# EAGLE board UniversalPPU (EAGLE 6.5.0)
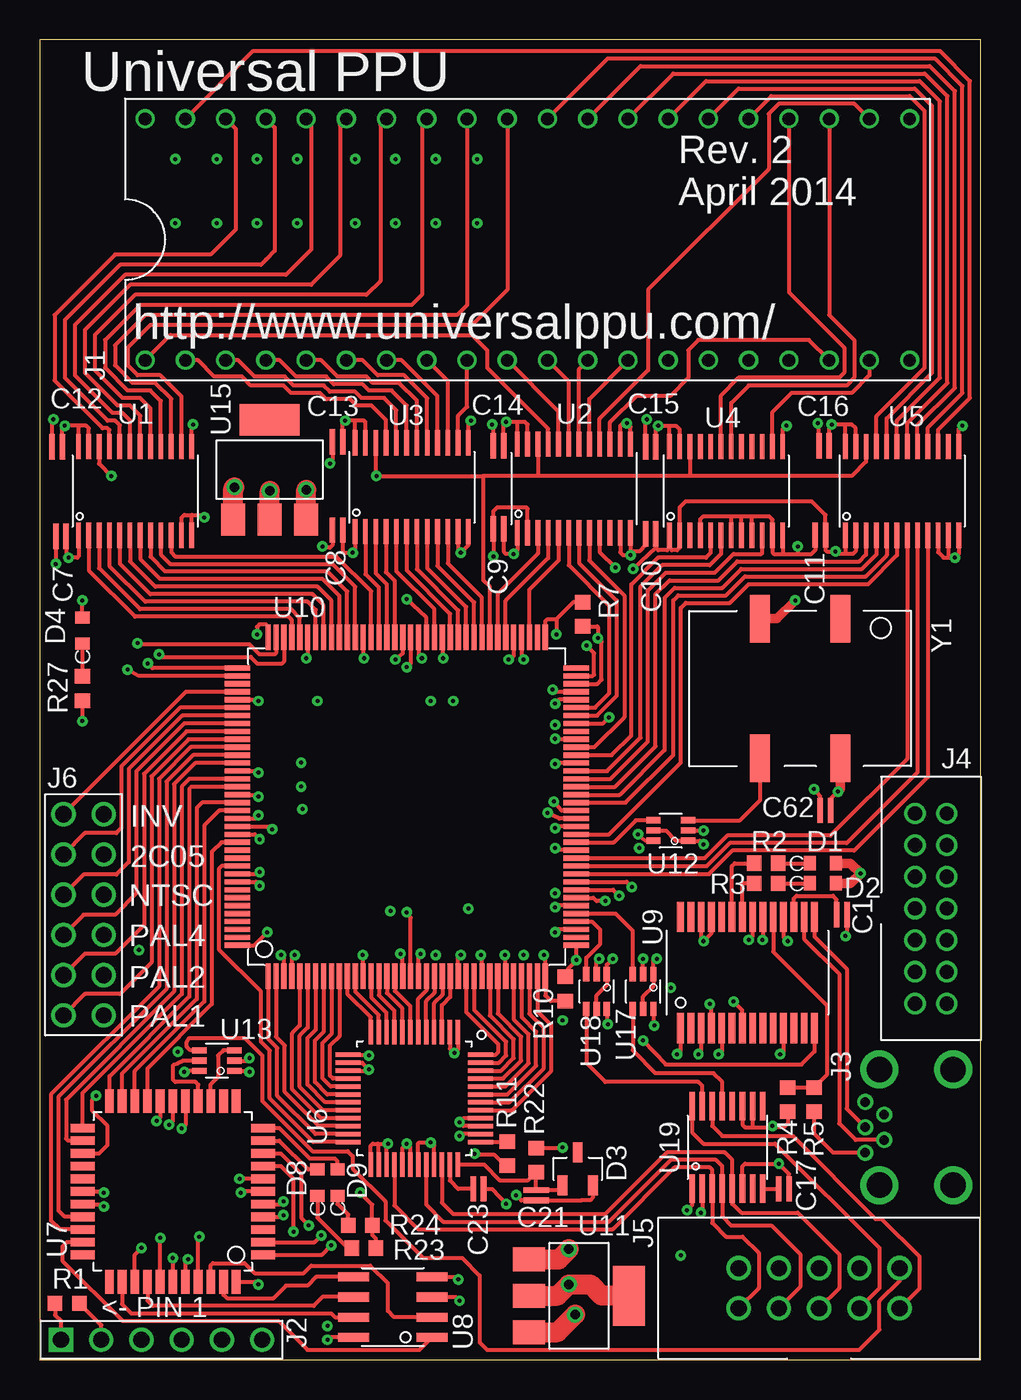
[diagram p6: board, top side]
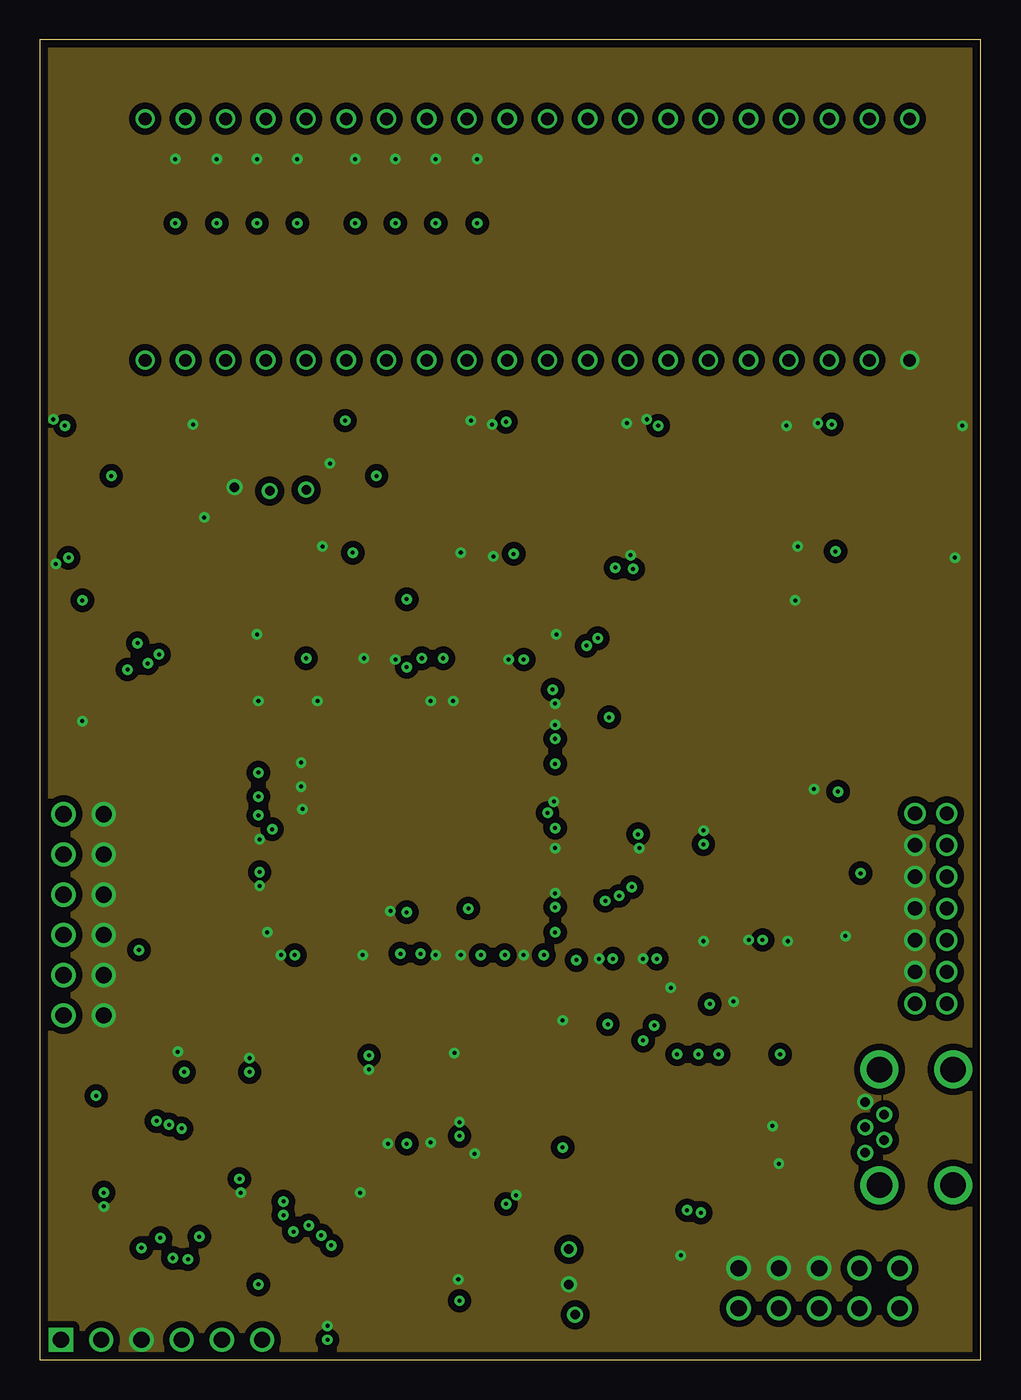
[diagram p7: board, inner layer Route2]
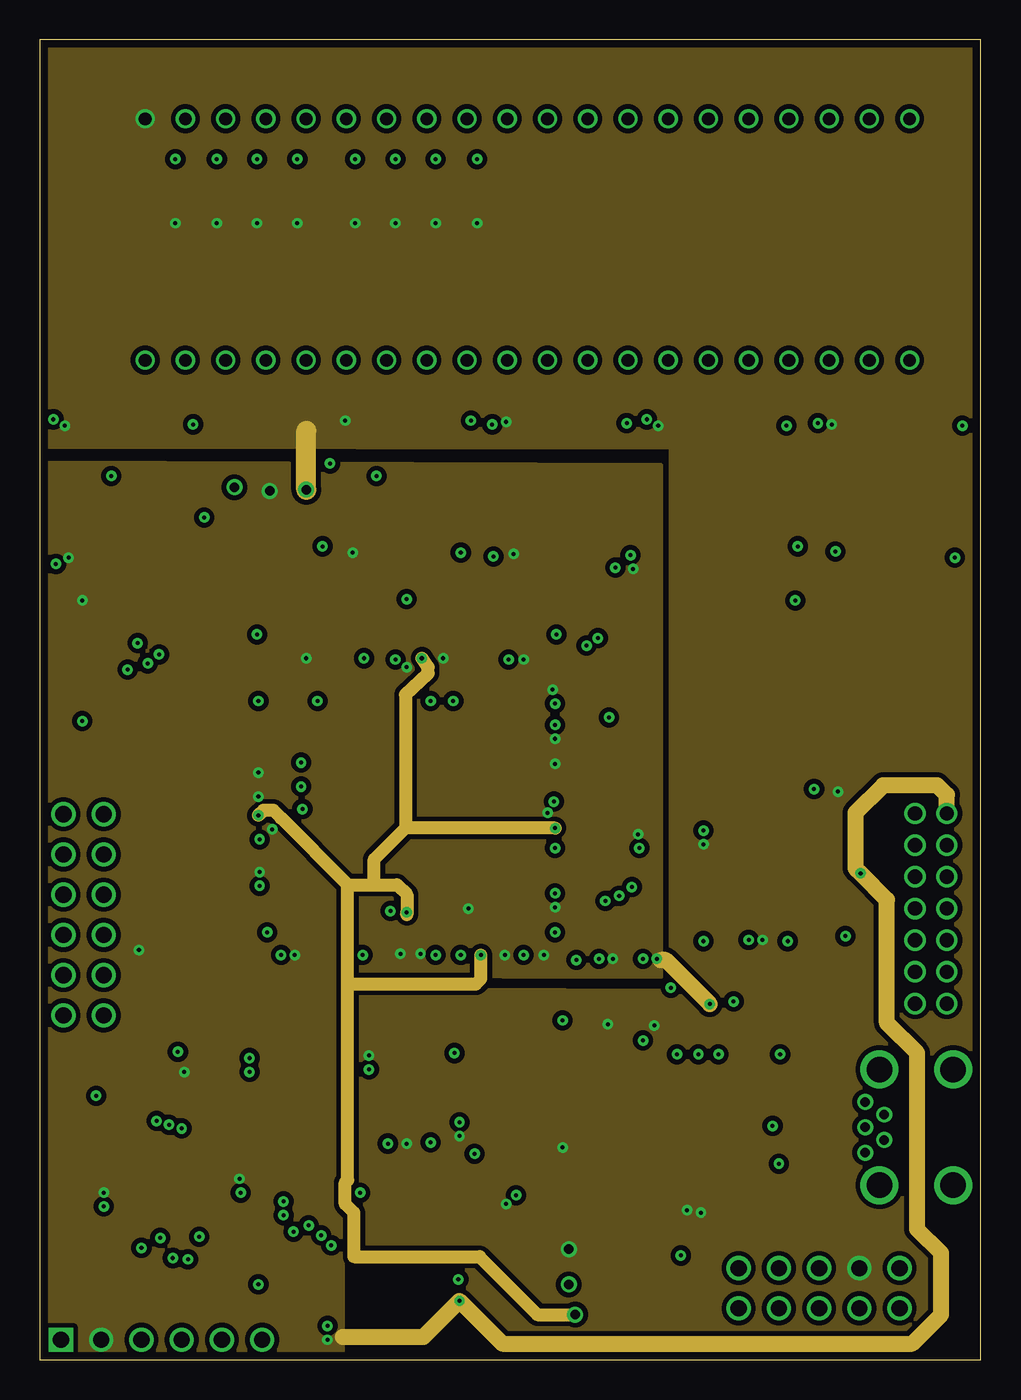
[diagram p8: board, inner layer Route15]
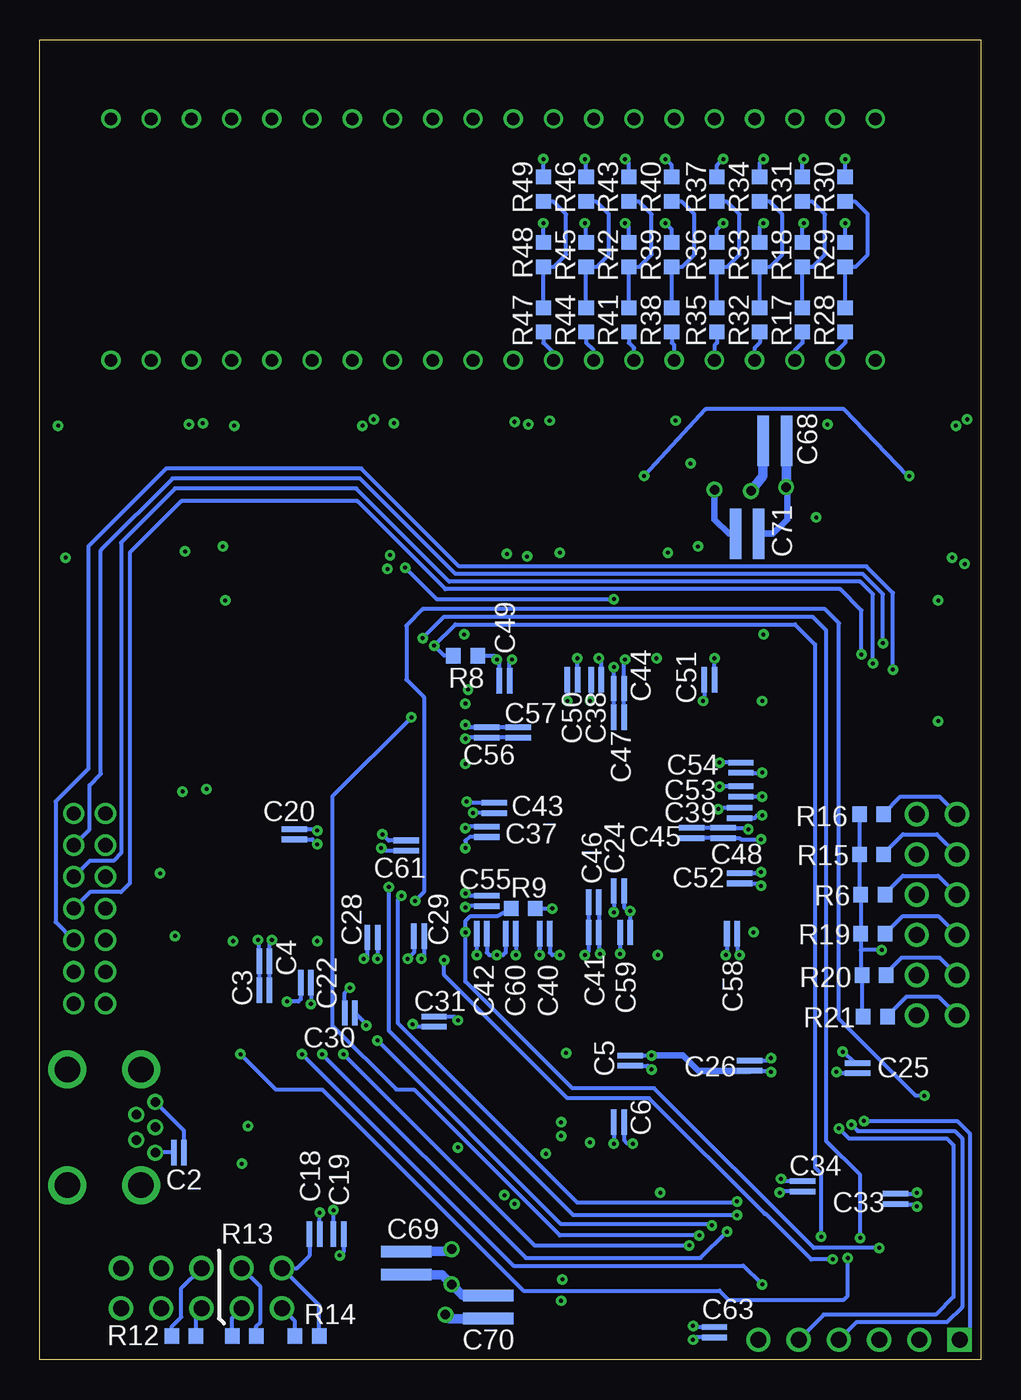
[diagram p9: board, bottom side, seen from below]

Size 59.43 x 83.34 mm. Coordinates in mm from the lower left corner, seen from the top.
Outline: 0,0 59.43,0 59.43,83.34 0,83.34 0,0
Copper layers (1+2*15+16): Top 0.0178mm / dielectric 12mil / Route2 0.0356mm / dielectric 28mil / Route15 0.0356mm / dielectric 12mil / Bottom 0.0178mm
Design rules "SSC-EAGLE-4Lyr_v1.0.0.3": minimum track width 6mil, minimum drill 8mil, track to track 6mil, track to pad 6mil, pad to pad 6mil, via to via 6mil, smd to smd 6mil, copper to edge 20mil, drill to drill 16mil, minimum pad ring 8mil, minimum via ring 8mil, stop-mask expansion 3mil, vias tented up to drill 0mil, thermal gap 10mil

## Footprints (pad centres in the part's own frame; a part is rotated, then mirrored left to right if it is on the bottom)
TDK_C0816 = smd 0.35 x 1.6: 1 -0.325,0; 2 0.325,0
TDK_C1632 = smd 0.725 x 3.2: 1 -0.738,0; 2 0.738,0
LED_0603 = smd 0.76 x 0.91: A 0.825,0; C -0.825,0
SOT-23-3 = smd 0.61 x 1.27: 1 -0.96,-1.04; 2 0.96,-1.04; 3 0,1.04
DIP40 = drill 0.8: 1 -7.62,24.13; 2 -7.62,21.59; 3 -7.62,19.05; 4 -7.62,16.51; 5 -7.62,13.97; 6 -7.62,11.43; 7 -7.62,8.89; 8 -7.62,6.35; 9 -7.62,3.81; 10 -7.62,1.27; 11 -7.62,-1.27; 12 -7.62,-3.81; 13 -7.62,-6.35; 14 -7.62,-8.89; 15 -7.62,-11.43; 16 -7.62,-13.97; 17 -7.62,-16.51; 18 -7.62,-19.05; 19 -7.62,-21.59; 20 -7.62,-24.13; 21 7.62,-24.13; 22 7.62,-21.59; 23 7.62,-19.05; 24 7.62,-16.51; 25 7.62,-13.97; 26 7.62,-11.43; 27 7.62,-8.89; 28 7.62,-6.35; 29 7.62,-3.81; 30 7.62,-1.27; 31 7.62,1.27; 32 7.62,3.81; 33 7.62,6.35; 34 7.62,8.89; 35 7.62,11.43; 36 7.62,13.97; 37 7.62,16.51; 38 7.62,19.05; 39 7.62,21.59; 40 7.62,24.13
6SIP = drill 1.016 square: 1 0,6.35 | drill 1.016: 2 0,3.81; 3 0,1.27; 4 0,-1.27; 5 0,-3.81; 6 0,-6.35
USB = drill 0.6: 1 1.6,-3.275; 2 0.8,-2.075; 3 0,-3.275; 4 -0.8,-2.075; 5 -1.6,-3.275 | drill 1.6: S1 3.65,-2.375; S2 3.65,2.275; S3 -3.65,-2.375; S4 -3.65,2.275
14PIN_2MM = drill 0.9: 1 1,-6; 2 -1,-6; 3 1,-4; 4 -1,-4; 5 1,-2; 6 -1,-2; 7 1,0; 8 -1,0; 9 1,2; 10 -1,2; 11 1,4; 12 -1,4; 13 1,6; 14 -1,6
10PIN = drill 1.016: 1 -5.08,-1.27; 2 -5.08,1.27; 3 -2.54,-1.27; 4 -2.54,1.27; 5 0,-1.27; 6 0,1.27; 7 2.54,-1.27; 8 2.54,1.27; 9 5.08,-1.27; 10 5.08,1.27
12PIN = drill 1.016: 1 -6.35,1.27; 2 -6.35,-1.27; 3 -3.81,1.27; 4 -3.81,-1.27; 5 -1.27,1.27; 6 -1.27,-1.27; 7 1.27,1.27; 8 1.27,-1.27; 9 3.81,1.27; 10 3.81,-1.27; 11 6.35,1.27; 12 6.35,-1.27
0603 = smd 0.914 x 0.965: P$1 -0.762,0; P$2 0.762,0
TSSOP24 = smd 1.6 x 0.3: 1 -2.8,3.575; 2 -2.8,2.925; 3 -2.8,2.275; 4 -2.8,1.625; 5 -2.8,0.975; 6 -2.8,0.325; 7 -2.8,-0.325; 8 -2.8,-0.975; 9 -2.8,-1.625; 10 -2.8,-2.275; 11 -2.8,-2.925; 12 -2.8,-3.575; 13 2.8,-3.575; 14 2.8,-2.925; 15 2.8,-2.275; 16 2.8,-1.625; 17 2.8,-0.975; 18 2.8,-0.325; 19 2.8,0.325; 20 2.8,0.975; 21 2.8,1.625; 22 2.8,2.275; 23 2.8,2.925; 24 2.8,3.575
LQFP-48 = smd 0.28 x 1.56: 1 -2.75,-4.18; 2 -2.25,-4.18; 3 -1.75,-4.18; 4 -1.25,-4.18; 5 -0.75,-4.18; 6 -0.25,-4.18; 7 0.25,-4.18; 8 0.75,-4.18; 9 1.25,-4.18; 10 1.75,-4.18; 11 2.25,-4.18; 12 2.75,-4.18; 25 2.75,4.18; 26 2.25,4.18; 27 1.75,4.18; 28 1.25,4.18; 29 0.75,4.18; 30 0.25,4.18; 31 -0.25,4.18; 32 -0.75,4.18; 33 -1.25,4.18; 34 -1.75,4.18; 35 -2.25,4.18; 36 -2.75,4.18 | smd 1.56 x 0.28: 13 4.18,-2.75; 14 4.18,-2.25; 15 4.18,-1.75; 16 4.18,-1.25; 17 4.18,-0.75; 18 4.18,-0.25; 19 4.18,0.25; 20 4.18,0.75; 21 4.18,1.25; 22 4.18,1.75; 23 4.18,2.25; 24 4.18,2.75; 37 -4.18,2.75; 38 -4.18,2.25; 39 -4.18,1.75; 40 -4.18,1.25; 41 -4.18,0.75; 42 -4.18,0.25; 43 -4.18,-0.25; 44 -4.18,-0.75; 45 -4.18,-1.25; 46 -4.18,-1.75; 47 -4.18,-2.25; 48 -4.18,-2.75
TQFP44 = smd 1.5 x 0.55: 1 -5.7,4; 2 -5.7,3.2; 3 -5.7,2.4; 4 -5.7,1.6; 5 -5.7,0.8; 6 -5.7,0; 7 -5.7,-0.8; 8 -5.7,-1.6; 9 -5.7,-2.4; 10 -5.7,-3.2; 11 -5.7,-4; 23 5.7,-4; 24 5.7,-3.2; 25 5.7,-2.4; 26 5.7,-1.6; 27 5.7,-0.8; 28 5.7,0; 29 5.7,0.8; 30 5.7,1.6; 31 5.7,2.4; 32 5.7,3.2; 33 5.7,4 | smd 0.55 x 1.5: 12 -4,-5.7; 13 -3.2,-5.7; 14 -2.4,-5.7; 15 -1.6,-5.7; 16 -0.8,-5.7; 17 0,-5.7; 18 0.8,-5.7; 19 1.6,-5.7; 20 2.4,-5.7; 21 3.2,-5.7; 22 4,-5.7; 34 4,5.7; 35 3.2,5.7; 36 2.4,5.7; 37 1.6,5.7; 38 0.8,5.7; 39 0,5.7; 40 -0.8,5.7; 41 -1.6,5.7; 42 -2.4,5.7; 43 -3.2,5.7; 44 -4,5.7
8PIN = smd 1.97 x 0.57: 1 -2.475,1.905; 2 -2.475,0.635; 3 -2.475,-0.635; 4 -2.475,-1.905; 5 2.475,-1.905; 6 2.475,-0.635; 7 2.475,0.635; 8 2.475,1.905
SSOP-28 = smd 1.9 x 0.43: 1 -3.505,4.225; 2 -3.505,3.575; 3 -3.505,2.925; 4 -3.505,2.275; 5 -3.505,1.625; 6 -3.505,0.975; 7 -3.505,0.325; 8 -3.505,-0.325; 9 -3.505,-0.975; 10 -3.505,-1.625; 11 -3.505,-2.275; 12 -3.505,-2.925; 13 -3.505,-3.575; 14 -3.505,-4.225; 15 3.505,-4.225; 16 3.505,-3.575; 17 3.505,-2.925; 18 3.505,-2.275; 19 3.505,-1.625; 20 3.505,-0.975; 21 3.505,-0.325; 22 3.505,0.325; 23 3.505,0.975; 24 3.505,1.625; 25 3.505,2.275; 26 3.505,2.925; 27 3.505,3.575; 28 3.505,4.225
TQG144 = smd 1.6 x 0.33: 1 -10.7,8.75; 2 -10.7,8.25; 3 -10.7,7.75; 4 -10.7,7.25; 5 -10.7,6.75; 6 -10.7,6.25; 7 -10.7,5.75; 8 -10.7,5.25; 9 -10.7,4.75; 10 -10.7,4.25; 11 -10.7,3.75; 12 -10.7,3.25; 13 -10.7,2.75; 14 -10.7,2.25; 15 -10.7,1.75; 16 -10.7,1.25; 17 -10.7,0.75; 18 -10.7,0.25; 19 -10.7,-0.25; 20 -10.7,-0.75; 21 -10.7,-1.25; 22 -10.7,-1.75; 23 -10.7,-2.25; 24 -10.7,-2.75; 25 -10.7,-3.25; 26 -10.7,-3.75; 27 -10.7,-4.25; 28 -10.7,-4.75; 29 -10.7,-5.25; 30 -10.7,-5.75; 31 -10.7,-6.25; 32 -10.7,-6.75; 33 -10.7,-7.25; 34 -10.7,-7.75; 35 -10.7,-8.25; 36 -10.7,-8.75; 73 10.7,-8.75; 74 10.7,-8.25; 75 10.7,-7.75; 76 10.7,-7.25; 77 10.7,-6.75; 78 10.7,-6.25; 79 10.7,-5.75; 80 10.7,-5.25; 81 10.7,-4.75; 82 10.7,-4.25; 83 10.7,-3.75; 84 10.7,-3.25; 85 10.7,-2.75; 86 10.7,-2.25; 87 10.7,-1.75; 88 10.7,-1.25; 89 10.7,-0.75; 90 10.7,-0.25; 91 10.7,0.25; 92 10.7,0.75; 93 10.7,1.25; 94 10.7,1.75; 95 10.7,2.25; 96 10.7,2.75; 97 10.7,3.25; 98 10.7,3.75; 99 10.7,4.25; 100 10.7,4.75; 101 10.7,5.25; 102 10.7,5.75; 103 10.7,6.25; 104 10.7,6.75; 105 10.7,7.25; 106 10.7,7.75; 107 10.7,8.25; 108 10.7,8.75 | smd 0.33 x 1.6: 37 -8.75,-10.7; 38 -8.25,-10.7; 39 -7.75,-10.7; 40 -7.25,-10.7; 41 -6.75,-10.7; 42 -6.25,-10.7; 43 -5.75,-10.7; 44 -5.25,-10.7; 45 -4.75,-10.7; 46 -4.25,-10.7; 47 -3.75,-10.7; 48 -3.25,-10.7; 49 -2.75,-10.7; 50 -2.25,-10.7; 51 -1.75,-10.7; 52 -1.25,-10.7; 53 -0.75,-10.7; 54 -0.25,-10.7; 55 0.25,-10.7; 56 0.75,-10.7; 57 1.25,-10.7; 58 1.75,-10.7; 59 2.25,-10.7; 60 2.75,-10.7; 61 3.25,-10.7; 62 3.75,-10.7; 63 4.25,-10.7; 64 4.75,-10.7; 65 5.25,-10.7; 66 5.75,-10.7; 67 6.25,-10.7; 68 6.75,-10.7; 69 7.25,-10.7; 70 7.75,-10.7; 71 8.25,-10.7; 72 8.75,-10.7; 109 8.75,10.7; 110 8.25,10.7; 111 7.75,10.7; 112 7.25,10.7; 113 6.75,10.7; 114 6.25,10.7; 115 5.75,10.7; 116 5.25,10.7; 117 4.75,10.7; 118 4.25,10.7; 119 3.75,10.7; 120 3.25,10.7; 121 2.75,10.7; 122 2.25,10.7; 123 1.75,10.7; 124 1.25,10.7; 125 0.75,10.7; 126 0.25,10.7; 127 -0.25,10.7; 128 -0.75,10.7; 129 -1.25,10.7; 130 -1.75,10.7; 131 -2.25,10.7; 132 -2.75,10.7; 133 -3.25,10.7; 134 -3.75,10.7; 135 -4.25,10.7; 136 -4.75,10.7; 137 -5.25,10.7; 138 -5.75,10.7; 139 -6.25,10.7; 140 -6.75,10.7; 141 -7.25,10.7; 142 -7.75,10.7; 143 -8.25,10.7; 144 -8.75,10.7
SOT-223 = smd 2 x 1.5: 1 -3.15,2.3; 2 -3.15,0; 3 -3.15,-2.3 | smd 2 x 3.8: 4 3.15,0
R-PDSO-G6 = smd 0.9 x 0.4: 1 -1.1,0.65; 2 -1.1,0; 3 -1.1,-0.65; 4 1.1,-0.65; 5 1.1,0; 6 1.1,0.65
R-PDSO-G16 = smd 1.8 x 0.35: 1 -2.6,2.223; 2 -2.6,1.587; 3 -2.6,0.953; 4 -2.6,0.318; 5 -2.6,-0.318; 6 -2.6,-0.953; 7 -2.6,-1.587; 8 -2.6,-2.223; 9 2.6,-2.223; 10 2.6,-1.587; 11 2.6,-0.953; 12 2.6,-0.318; 13 2.6,0.318; 14 2.6,0.953; 15 2.6,1.587; 16 2.6,2.223
OSC = smd 3 x 1.27: 1 -4.4,2.54; 2 -4.4,-2.54; 3 4.4,-2.54; 4 4.4,2.54

## Placement (x,y rotation side)
C1  0.1u  [TDK_C0816]  50.64,28.1 0 top
C2  10n  [TDK_C0816]  50.64,13.1 180 bottom
C3  0.1u  [TDK_C0816]  45.24,23.34 180 bottom
C4  4.7u  [TDK_C0816]  45.24,25.16 180 bottom
C5  0.1u  [TDK_C0816]  22.15,18.89 90 bottom
C6  0.1u  [TDK_C0816]  22.86,15 180 bottom
C7  0.1u  [TDK_C0816]  1.35,51.99 0 top
C8  0.1u  [TDK_C0816]  18.81,52.39 0 top
C9  0.1u  [TDK_C0816]  28.97,52.47 0 top
C10  0.1u  [TDK_C0816]  38.58,52.15 0 top
C11  0.1u  [TDK_C0816]  49.29,52.07 0 top
C12  0.1u  [TDK_C0816]  1.11,57.63 0 top
C13  0.1u  [TDK_C0816]  18.81,57.94 0 top
C14  0.1u  [TDK_C0816]  28.97,57.71 0 top
C15  0.1u  [TDK_C0816]  38.58,57.63 0 top
C16  0.1u  [TDK_C0816]  49.53,57.71 0 top
C17  0.22u  [TDK_C0816]  46.99,10.79 180 top
C18  0.1u  [TDK_C0816]  42.07,7.94 0 bottom
C19  0.1u  [TDK_C0816]  40.56,7.94 180 bottom
C20  0.1u  [TDK_C0816]  43.34,33.18 270 bottom
C21  0.1u  [TDK_C0816]  31.35,10.4 90 top
C22  0.1u  [TDK_C0816]  42.62,23.81 0 bottom
C23  0.1u  [TDK_C0816]  27.7,10.79 0 top
C24  4.7u  [TDK_C0816]  22.86,29.61 180 bottom
C25  0.1u  [TDK_C0816]  7.78,18.41 270 bottom
C26  0.1u  [TDK_C0816]  14.61,18.57 270 bottom
C28  0.1u  [TDK_C0816]  38.42,26.67 180 bottom
C29  0.1u  [TDK_C0816]  35.48,26.75 180 bottom
C30  0.1u  [TDK_C0816]  39.85,21.91 0 bottom
C31  0.1u  [TDK_C0816]  34.53,21.35 270 bottom
C33  0.1u  [TDK_C0816]  5.4,10.16 90 bottom
C34  0.1u  [TDK_C0816]  11.27,10.95 90 bottom
C37  4.7u  [TDK_C0816]  31.19,33.34 90 bottom
C38  4.7u  [TDK_C0816]  24.29,42.94 0 bottom
C39  4.7u  [TDK_C0816]  15.24,34.53 270 bottom
C40  0.47u  [TDK_C0816]  27.54,26.91 180 bottom
C41  4.7u  [TDK_C0816]  24.45,26.99 0 bottom
C42  4.7u  [TDK_C0816]  31.51,26.91 180 bottom
C43  4.7u  [TDK_C0816]  30.72,34.85 270 bottom
C44  4.7u  [TDK_C0816]  22.86,42.39 180 bottom
C45  4.7u  [TDK_C0816]  18.26,33.26 90 bottom
C46  4.7u  [TDK_C0816]  24.45,28.89 0 bottom
C47  4.7u  [TDK_C0816]  22.86,40.56 180 bottom
C48  0.47u  [TDK_C0816]  16.27,33.26 90 bottom
C49  4.7u  [TDK_C0816]  30.08,42.86 180 bottom
C50  0.47u  [TDK_C0816]  25.8,42.94 0 bottom
C51  0.47u  [TDK_C0816]  17.14,42.94 0 bottom
C52  4.7u  [TDK_C0816]  15.24,30.4 90 bottom
C53  0.47u  [TDK_C0816]  15.16,35.88 270 bottom
C54  0.47u  [TDK_C0816]  15.16,37.39 270 bottom
C55  4.7u  [TDK_C0816]  31.19,28.97 270 bottom
C56  0.47u  [TDK_C0816]  31.19,39.61 270 bottom
C57  0.47u  [TDK_C0816]  29.21,39.61 270 bottom
C58  4.7u  [TDK_C0816]  15.72,26.91 180 bottom
C59  0.47u  [TDK_C0816]  22.46,26.99 180 bottom
C60  0.47u  [TDK_C0816]  29.69,26.91 0 bottom
C61  0.1u  [TDK_C0816]  36.27,32.46 90 bottom
C62  0.1u  [TDK_C0816]  49.61,34.69 0 top
C63  0.1u  [TDK_C0816]  16.83,1.75 270 bottom
C68  10u  [TDK_C1632]  13.02,58.02 180 bottom
C69  10u  [TDK_C1632]  36.27,6.11 90 bottom
C70  10u  [TDK_C1632]  31.11,3.33 270 bottom
C71  10u  [TDK_C1632]  14.76,52.15 180 bottom
D1  DIODE  [LED_0603]  49.45,31.35 0 top
D2  DIODE  [LED_0603]  49.45,30.08 0 top
D3  AD1580  [SOT-23-3]  33.97,12.06 0 top
D4  DIODE  [LED_0603]  2.7,46.04 90 top
D8  DIODE  [LED_0603]  17.54,11.19 90 top
D9  DIODE  [LED_0603]  18.81,11.19 90 top
J1  DIP40  [DIP40]  30.8,70.72 90 top
J2  PICKIT3  [6SIP]  7.7,1.27 90 top
J3  USB  [USB]  55.4,14.68 270 top
J4  JTAG  [14PIN_2MM]  56.28,28.5 180 top
J5  10PIN  [10PIN]  49.21,4.52 0 top
J6  12PIN  [12PIN]  2.78,28.1 90 top
R1  10k  [0603]  1.75,3.57 0 top
R2  100  [0603]  45.88,31.35 180 top
R3  100  [0603]  45.88,30.08 180 top
R4  10k  [0603]  47.23,16.43 90 top
R5  4.7k  [0603]  48.9,16.43 270 top
R6  10k  [0603]  6.83,29.37 180 bottom
R7  1k  [0603]  34.29,47.07 270 top
R8  330  [0603]  32.54,44.45 0 bottom
R9  4.7k  [0603]  28.89,28.5 0 bottom
R10  4.7k  [0603]  33.18,23.42 270 top
R11  536  [0603]  29.53,13.02 90 top
R12  75  [0603]  50.32,1.51 0 bottom
R13  75  [0603]  46.51,1.51 180 bottom
R14  75  [0603]  42.55,1.51 180 bottom
R15  10k  [0603]  6.91,31.91 180 bottom
R16  10k  [0603]  6.91,34.45 180 bottom
R17  10k  [0603]  11.27,65.64 90 bottom
R18  0  [0603]  11.27,69.77 90 bottom
R19  10k  [0603]  6.83,26.91 180 bottom
R20  10k  [0603]  6.75,24.29 180 bottom
R21  10k  [0603]  6.67,21.67 180 bottom
R22  1k  [0603]  31.35,12.62 90 top
R23  100  [0603]  20.48,7.06 180 top
R24  100  [0603]  20.24,8.49 180 top
R27  100  [0603]  2.7,42.39 90 top
R28  10k  [0603]  8.57,65.64 90 bottom
R29  0  [0603]  8.57,69.77 90 bottom
R30  0  [0603]  8.57,73.9 270 bottom
R31  0  [0603]  11.27,73.9 270 bottom
R32  10k  [0603]  13.97,65.64 90 bottom
R33  0  [0603]  13.97,69.77 90 bottom
R34  0  [0603]  13.97,73.9 270 bottom
R35  10k  [0603]  16.67,65.64 90 bottom
R36  0  [0603]  16.67,69.77 90 bottom
R37  0  [0603]  16.67,73.9 270 bottom
R38  10k  [0603]  19.53,65.64 90 bottom
R39  0  [0603]  19.53,69.77 90 bottom
R40  0  [0603]  19.53,73.9 270 bottom
R41  10k  [0603]  22.23,65.64 90 bottom
R42  0  [0603]  22.23,69.77 90 bottom
R43  0  [0603]  22.23,73.9 270 bottom
R44  10k  [0603]  24.92,65.64 90 bottom
R45  0  [0603]  24.92,69.77 90 bottom
R46  0  [0603]  24.92,73.9 270 bottom
R47  10k  [0603]  27.62,65.64 90 bottom
R48  0  [0603]  27.62,69.77 90 bottom
R49  0  [0603]  27.62,73.9 270 bottom
U1  SN74LVC8T245  [TSSOP24]  6.03,54.85 90 top
U2  SN74LVC8T245  [TSSOP24]  33.73,55.01 90 top
U3  SN74LVC8T245  [TSSOP24]  23.5,55.09 90 top
U4  SN74LVC8T245  [TSSOP24]  43.34,54.85 90 top
U5  SN74LVC8T245  [TSSOP24]  54.45,54.85 90 top
U6  ADV7125  [LQFP-48]  23.65,16.51 180 top
U7  PIC18(L)F4XK22  [TQFP44]  8.41,10.64 180 top
U8  M25P40  [8PIN]  22.3,3.33 180 top
U9  FT232RL  [SSOP-28]  44.69,24.45 90 top
U10  XC6SLX9  [TQG144]  23.18,34.92 90 top
U11  1.2  [SOT-223]  34.05,4.05 0 top
U12  74LVC1T45  [R-PDSO-G6]  39.85,33.42 180 top
U13  74LVC1T45  [R-PDSO-G6]  11.19,18.89 180 top
U15  2.5  [SOT-223]  14.53,56.2 90 top
U17  74LVC1T45  [R-PDSO-G6]  38.1,23.26 270 top
U18  74LVC1T45  [R-PDSO-G6]  35.16,23.26 270 top
U19  TPD7S019  [R-PDSO-G16]  43.42,13.41 90 top
Y1  OSC  [OSC]  48.02,42.39 270 top

## Tracks (layer width: path | path; a pad name or v marks a point on that pad's centre or on a via)
+1V2  (via drill 0.25, 0.6 pad 0.25)
  Top 0.254: U10.128 13.62,34.17 v13.81,34.37 | U10.28 27.93,25.49 v27.86,25.56 | U10.52 32.64,33.67 v32.54,33.58 | U10.89 23.93,44.34 v24.13,44.29 | U10.19 23.43,27.93 v23.18,28.26
  Top 1.27: U11.3 32.7,1.75 v33.81,2.86
  Route15 0.813: 19.45,23.73 19.45,11.35 19.29,11.19 19.29,9.84 19.84,9.29 19.84,6.51 27.78,6.51 31.43,2.86 v33.81,2.86 | 19.45,23.73 19.45,30 | 19.45,30 21.12,30 | 19.45,23.73 27.54,23.73 27.86,24.05 v27.86,25.56 | v32.54,33.58 23.1,33.58 | v24.13,44.29 24.53,43.74 24.53,43.34 23.1,41.99 23.1,33.58 | 21.12,30 21.12,31.6 23.1,33.58 | 21.12,30 22.56,30 23.18,29.37 23.18,28.11 v23.18,28.26 | 19.45,30 C39.2 14.76,34.69 14.13,34.69 v13.81,34.37
  Bottom 0.254: C39.2 14.29,34.2 14.13,34.37 v13.81,34.37 | C40.2 v27.87,25.57 v27.86,25.56 | C38.2 23.96,44.28 v24.13,44.29 | C24.2 23.18,28.11 v23.18,28.26 | C37.2 32.46,33.66 v32.54,33.58
  Bottom 0.61: C70.2 33.55,2.6 v33.81,2.86
+2V5  (via drill 0.25, 0.6 pad 0.25)
  Top 0.254: U10.135 13.77,30.68 v13.89,30.8 | U10.129 14.59,33.67 v14.68,33.5 | U10.18 22.93,25.49 v22.78,25.64 | U10.20 23.93,25.52 v24.05,25.64 | U10.31 29.43,25.42 v29.37,25.56 | v31.83,25.56 31.93,25.46 U10.36 31.93,23 32.27,22.65 R10.P$2 | U10.42 32.72,28.68 v32.54,28.57 | U10.4 15.93,25.45 v16.11,25.56 | U10.53 32.82,34.17 v32.07,34.53 | U10.63 32.58,39.17 v32.54,39.21 | U10.90 23.43,43.99 v23.18,43.74 | U10.86 25.43,44.34 v25.48,44.29 | U10.76 30.43,44.26 v30.56,44.21 | U10.103 16.93,44.39 v16.83,44.29 | U10.122 13.7,37.17 v13.81,37.07 | U10.125 13.7,35.67 v13.81,35.56 | U9.4 42.41,22.36 v42.31,22.46 | v4.05,10.56 3.89,10.64 U7.28 | U7.7 v12.63,11.44 v12.62,11.43 | C7.2 1.67,50.79 v1.83,50.64 2.38,50.64 2.46,50.72 U1.1 | U3.1 19.92,51.11 v19.76,50.96 19.21,50.96 19.14,51.03 C8.2 | C9.2 29.3,51.03 29.45,50.88 v29.92,50.88 30.16,51.11 U2.1 | U13.6 9.27,18.24 v9.13,18.18 | v38.97,25.32 38.75,25.18 U17.1 38.75,23.59 38.1,22.94 U17.5 | J2.2 3.89,2.19 R1.P$2 | D4.A v2.7,47.94 | C10.2 38.9,51.28 | 38.9,51.28 v37.47,49.93 | U4.1 39.76,51.27 | 39.76,51.27 39.61,51.12 39.07,51.12 38.9,51.28 | 39.76,51.27 39.92,51.12 40.24,51.12 40.41,51.29 U4.2 40.41,53.83 40.8,54.21 48.74,54.21 49.62,53.33 C11.2 49.62,51.11 49.69,51.04 v50.24,51.04 50.4,50.88 50.8,50.88 | U5.2 51.53,51.05 51.36,50.88 50.8,50.88 | U5.1 50.88,50.96 50.8,50.88 | U10.60 32.59,37.67 v32.54,37.62 | U10.69 32.49,42.17 v32.38,42.31 | U18.5 35.16,23.02 35.81,23.67 U18.1 35.81,24.94 v36.2,25.32 | v37.78,33.18 37.94,33.02 38.26,32.78 38.73,32.78 U12.6 | U8.8 18.34,1.43 v18.18,1.27 | U8.3 26.27,3.97 v26.51,3.73
  Top 0.61: D1.A 51.2,31.35 v51.83,30.72 51.2,30.08 D2.A
  Top 1.27: U15.2 v14.53,54.85
  Route15 1.016: v42.31,22.46 39.53,25.24 39.21,25.24 | 19.13,1.43 24.21,1.43 v26.51,3.73 29.21,1.03 55.09,1.03 56.91,2.86 56.91,6.75 55.4,8.26 55.4,19.37 53.5,21.27 53.5,29.05 v51.83,30.72 51.51,31.04 51.51,34.53 53.26,36.27 56.67,36.27 57.28,35.67 J4.2
  Bottom 0.254: v13.89,30.8 13.97,30.72 15.07,30.72 C52.2 | C45.2 C48.2 14.69,33.58 v14.68,33.5 | C59.2 v22.79,25.63 v22.78,25.64 | v24.05,25.64 24.12,25.71 C41.2 C46.2 | C60.2 v29.36,25.57 v29.37,25.56 | C42.2 31.84,25.49 v31.83,25.56 | C55.2 32.55,28.65 v32.54,28.57 | C58.2 16.04,25.57 v16.11,25.56 | v32.54,39.21 32.47,39.28 C56.2 C57.2 | 13.81,36.99 v13.81,37.07 v13.82,37.06 C54.2 | C47.2 C44.2 23.18,43.73 v23.18,43.74 | C50.2 v25.47,44.28 v25.48,44.29 | C49.2 30.41,44.14 v30.56,44.21 30.72,44.45 R8.P$2 | C51.2 v16.82,44.28 v16.83,44.29 | C53.2 v13.82,35.55 v13.81,35.56 | C22.2 42.3,22.47 v42.31,22.46 | C33.2 4.06,10.48 v4.05,10.56 | C34.2 12.47,11.28 v12.62,11.43 | C25.2 9.12,18.09 v9.13,18.18 | C28.2 38.74,25.31 v38.97,25.32 | R16.P$2 R15.P$2 7.67,29.45 R6.P$2 R19.P$2 7.59,25.88 | 7.59,25.88 7.59,24.37 R20.P$2 7.51,21.75 R21.P$2 | R9.P$2 v27.07,28.5 | v6.27,25.88 7.59,25.88 | C43.2 31.98,34.52 v32.07,34.53 | C61.2 37.39,32.79 v37.78,33.18 | C63.2 18.09,1.42 v18.18,1.27 | C29.2 35.81,25.71 v36.2,25.32
  Bottom 0.61: v14.53,54.85 13.76,55.78 C68.2
  pour Route15 (isolate 0.305, no thermals): 0.16,56.67 39.21,56.52 39.21,24.13 19.13,24.21 19.13,0.24 0.16,0.32
+5V  (via drill 0.25, 0.6 pad 0.25)
  Top 0.254: U9.20 45.66,26.61 v45.64,26.51 | U6.29 22.9,13.38 v23.18,13.65 23.4,13.43 U6.30 | U6.13 20.67,19.26 v20.8,19.21 | U19.1 41.2,9.76 v40.88,9.45 | U19.2 41.83,9.37 v41.75,9.29 | U2.23 30.81,59.04 30.64,59.21 30.16,59.21 | C14.2 29.3,59.06 v29.45,59.21 30.16,59.21 | U2.24 30.16,59.21 | C15.2 38.9,58.82 v39.05,58.98 39.69,58.98 | 39.69,58.98 40.16,58.98 40.41,58.73 U4.23 | U4.24 39.76,58.9 39.69,58.98 | C16.2 49.85,58.9 v50.01,59.05 50.88,59.05 | U5.23 51.53,58.8 51.28,59.05 50.88,59.05 | U5.24 50.88,59.05 | C13.2 19.14,59.14 v19.29,59.29 19.92,59.29 | U3.23 20.57,59.2 20.48,59.29 19.92,59.29 | U3.24 19.92,59.29 | C12.2 1.44,58.82 v1.59,58.98 2.54,58.98 | U1.23 3.11,58.8 2.94,58.98 2.54,58.98 | U1.24 2.46,58.89 2.54,58.98 | U13.1 13.16,18.24 v13.26,18.18 | U17.6 38.75,21.34 v38.81,21.11 | U18.6 35.81,21.29 v35.88,21.19 | C23.2 28.57,10.79 v29.45,9.84 | R22.P$2 32.99,13.38 v33.02,13.41 | C62.2 50.01,35.49 v50.4,35.88 | U12.5 39.53,33.42 40.18,32.77 U12.1 41.69,32.77 v41.91,32.54 | U6.38 26.56,14.26 v26.51,14.13
  Top 0.61: Y1.4 50.56,36.04 v50.4,35.88
  Top 1.27: U11.1 32.78,6.35 v33.42,6.99 | U15.3 v16.83,54.93
  Route15 1.27: v16.83,54.93 16.83,58.66
  Bottom 0.254: v45.64,26.51 45.57,26.5 C4.2 C3.2 | C6.2 v23.18,13.66 v23.18,13.65 | C5.2 20.88,19.22 v20.8,19.21 | C19.2 40.89,9.44 v40.88,9.45 | C18.2 v41.74,9.28 v41.75,9.29 | C26.2 13.18,18.25 v13.26,18.18 | v38.81,21.11 38.81,21.2 C30.2 | C31.2 35.55,21.03 v35.88,21.19 | R29.P$2 v8.57,71.75 | R48.P$2 v27.62,71.75 | R18.P$2 11.27,71.68 v11.19,71.75 | R33.P$2 13.97,71.52 v13.73,71.75 | R36.P$2 16.67,71.36 v16.27,71.75 | R39.P$2 19.53,71.36 v19.92,71.75 | R42.P$2 22.23,71.52 v22.46,71.75 | R45.P$2 24.92,71.68 v25,71.75 | C20.2 42.22,32.85 v41.91,32.54
  Bottom 0.406: C26.2 17.85,18.25 18.81,19.21 v20.8,19.21 | C71.2 15.93,52.15 U15.3 v16.83,54.93
  Bottom 0.61: C69.2 33.55,6.85 v33.42,6.99
  pour Route15 (isolate 0.305, no thermals): 0.08,83.34 59.45,83.34 59.45,0 20,0 20,23.42 39.85,23.34 39.85,57.55 0.08,57.63
/CS
  Top 0.254: U2.17 34.71,60.66 J1.13
/INT
  Top 0.254: J1.19 52.39,62.15 51.28,61.04 47.47,61.04 46.26,59.84 U4.14
/RD
  Top 0.254: J1.24 47.31,67.39 50.8,63.9 50.8,62.31 50.48,61.99 44.13,61.99 43.01,60.87 U4.19
/RST
  Top 0.254: J1.22 51.44,79.3 46.67,79.3 46.04,78.66 46.04,75.17 38.42,67.55 38.42,62.47 35.36,59.41 U2.16
/WR
  Top 0.254: J1.23 49.85,65.96 51.44,64.37 51.44,61.99 50.96,61.52 44.77,61.52 43.66,60.41 U4.18
A0
  Top 0.254: U2.18 34.06,62.55 J1.12
A1
  Top 0.254: U2.19 33.41,61.76 J1.11
A2
  Top 0.254: U2.20 32.76,59.87 J1.10
A8
  Top 0.254: J1.30 35.88,82.15 56.52,82.15 58.26,80.41 58.26,61.04 56.08,58.85 U5.16
A9
  Top 0.254: J1.29 37.94,81.68 56.2,81.68 57.78,80.09 57.78,61.36 55.43,59 U5.17
A10
  Top 0.254: J1.28 40.01,81.2 55.88,81.2 57.31,79.77 57.31,61.67 54.78,59.14 U5.18
A11
  Top 0.254: J1.27 42.07,80.72 55.56,80.72 56.83,79.45 56.83,61.99 54.13,59.29 U5.19
A12
  Top 0.254: J1.26 44.13,80.25 55.24,80.25 56.36,79.14 56.36,62.31 53.48,59.43 U5.20
A13
  Top 0.254: J1.25 46.2,79.77 54.93,79.77 55.88,78.82 55.88,62.63 52.83,59.57 U5.21
AD0
  Top 0.254: J1.38 12.38,77.71 12.38,71.36 12.14,71.12 11.75,70.72 10.79,69.77 4.76,69.77 0.95,65.96 0.95,61.83 3.97,58.82 4.29,58.82 4.41,58.7 U1.21
AD1
  Top 0.254: J1.37 14.84,77.79 14.84,70.01 14.29,69.45 13.97,69.14 5.08,69.14 1.59,65.64 1.59,61.99 4.29,59.29 4.76,59.29 5.06,59 U1.20
AD2
  Top 0.254: J1.36 17.14,78.03 17.14,70.09 16.83,69.77 15.56,68.5 5.4,68.5 2.22,65.33 2.22,62.15 4.6,59.77 5.24,59.77 5.71,59.3 U1.19
AD3
  Top 0.254: J1.35 18.97,77.95 18.97,69.69 17.14,67.87 5.71,67.87 2.86,65.01 2.86,62.31 4.92,60.25 5.71,60.25 6.36,59.6 U1.18
AD4
  Top 0.254: J1.34 21.51,77.95 21.51,68.1 20.64,67.23 6.03,67.23 3.49,64.69 3.49,62.47 5.24,60.72 6.35,60.72 7.01,60.06 U1.17
AD5
  Top 0.254: J1.33 24.13,78.03 24.13,67.23 23.5,66.6 6.35,66.6 4.13,64.37 4.13,62.63 5.56,61.2 6.99,61.2 7.66,60.53 U1.16
AD6
  Top 0.254: J1.32 26.99,66.6 26.35,65.96 6.67,65.96 4.76,64.06 4.76,62.79 5.87,61.67 7.3,61.67 8.31,60.67 U1.15
AD7
  Top 0.254: J1.31 29.53,67.55 27.3,65.33 6.99,65.33 5.56,63.9 5.56,62.79 6.19,62.15 7.62,62.15 8.96,60.81 U1.14
ALE
  Top 0.254: J1.39 13.49,82.63 56.83,82.63 58.74,80.72 58.74,60.72 56.73,58.71 U5.15
CLK
  Top 0.254: J1.18 48.58,64.37 41.59,64.37 40.96,63.74 40.96,61.99 39.85,60.88 37.7,60.88 36.01,59.19 U2.15
CSYNC
  Top 0.254: U10.41 36.36,28.18 37.45,27.08 U17.3
D0
  Top 0.254: U3.21 21.87,59.33 20.95,60.25 20,60.25 19.61,60.64 18.1,60.64 17.7,61.04 15.88,61.04 15.4,61.52 13.34,61.52 12.78,62.07 11.03,62.07 10,63.1 J1.2
  Bottom 0.254: R28.P$1 8.57,64.21 9.21,63.58 J1.2
D1
  Top 0.254: U3.20 22.52,59.95 21.75,60.72 20.32,60.72 19.92,61.12 18.34,61.12 17.94,61.52 16.03,61.52 15.48,62.07 13.57,62.07 12.54,63.1 J1.3
  Bottom 0.254: R17.P$1 11.27,64.21 11.75,63.74 J1.3
D2
  Top 0.254: U3.19 23.17,60.25 22.23,61.2 20.8,61.2 20.4,61.59 18.57,61.59 18.1,62.07 16.19,62.07 15.16,63.1 J1.4
  Bottom 0.254: R32.P$1 13.97,64.21 14.29,63.9 J1.4
D3
  Top 0.254: U3.18 23.82,60.56 22.7,61.67 21.03,61.67 20.64,62.07 18.81,62.07 17.78,63.1 J1.5
  Bottom 0.254: R35.P$1 16.67,64.21 16.83,64.06 J1.5
D4
  Top 0.254: U3.17 24.47,60.7 23.02,62.15 21.35,62.15 20.4,63.1 J1.6
  Bottom 0.254: R38.P$1 19.53,64.21 19.37,64.06 J1.6
D5
  Top 0.254: U3.16 25.12,60.84 22.86,63.1 J1.7
  Bottom 0.254: R41.P$1 22.23,64.21 21.91,63.9 J1.7
D6
  Top 0.254: U3.15 25.77,61.78 J1.8
  Bottom 0.254: R44.P$1 24.92,64.21 24.45,63.74 J1.8
D7
  Top 0.254: U3.14 26.42,59.6 26.99,60.17 J1.9
  Bottom 0.254: R47.P$1 27.62,64.21 26.99,63.58 J1.9
DGND  (via drill 0.25, 0.6 pad 0.25)
  Top 0.254: U10.136 13.64,30.18 v13.89,29.92 | U10.130 13.58,33.17 v13.89,32.86 | U10.3 15.43,25.45 v15.24,25.56 | U10.77 29.93,44.45 v29.61,44.21 | U10.91 22.93,44.6 v22.46,44.21 | U13.2 13.18,18.89 v13.26,19.05 | U7.6 12.78,10.64 v12.7,10.56 | U7.29 3.98,9.84 v4.05,9.68 | U6.14 20.37,18.76 v20.8,18.34 20.72,18.26 U6.15 | U10.113 13.73,41.67 v13.81,41.59 | U10.96 20.43,44.34 v20.48,44.29 | D3.2 34.93,10.25 34.77,10.08 34.21,10.08 34.2,10.07 C21.1 30.41,10.07 v30.08,10.4 | U6.27 21.9,13.57 v21.99,13.65 21.35,13.65 | U6.25 20.9,13.52 21.03,13.65 21.35,13.65 | U6.26 21.4,13.6 21.35,13.65 | U6.33 24.9,13.51 v24.69,13.73 23.97,13.73 23.9,13.66 U6.31 | U6.39 26.75,14.76 v26.51,15 26.77,15.26 U6.40 | U10.25 26.43,25.4 v26.59,25.56 | U10.13 20.43,25.53 v20.4,25.56 | U10.49 32.67,32.17 v32.54,32.31 | U12.2 v41.91,33.42 | U10.54 32.95,34.67 v32.46,35.24 | U9.21 45.01,26.76 v44.77,26.51 | U6.2 25.9,19.66 v26.19,19.37 26.4,19.58 U6.1 | R27.P$1 v2.7,40.32 | U10.68 32.78,41.67 v32.54,41.43 | U10.73 31.93,46.61 32.07,46.75 32.62,46.75 | 32.62,46.75 v32.62,45.8 | U10.108 14.43,46.29 14.29,46.43 13.89,46.43 13.73,46.28 v13.73,45.8 | C7.1 1.02,50.25 v1.03,50.24 | C12.1 0.79,59.29 v0.87,59.37 | U1.13 9.61,58.98 v9.68,59.05 | U1.11 8.96,53.17 9.13,53.34 9.6,53.34 | 9.6,53.34 10.24,53.34 v10.4,53.18 | U1.12 9.61,53.34 9.6,53.34 | C13.1 18.49,56.83 v18.34,56.59 | C8.1 18.49,51.43 18.34,51.28 18.02,51.28 v17.86,51.36 | U3.11 26.42,51.13 v26.59,50.96 27.07,51.44 U3.12 | U3.13 27.07,59.14 v27.23,59.29 | C14.1 28.65,58.98 v28.57,59.05 | v28.65,50.72 v28.65,50.73 C9.1 28.65,53.57 28.89,53.82 30.72,53.82 30.81,53.73 U2.2 | U2.14 36.66,58.96 36.83,59.13 v37.07,59.13 37.31,58.89 U2.13
  Top 0.254: C15.1 38.25,59.29 v38.34,59.37 | U2.11 36.66,50.97 36.83,50.8 v37.31,50.8 | C10.1 38.25,51.43 37.86,51.04 37.54,51.04 v37.31,50.8 | U2.12 v37.31,50.8 | U4.13 46.91,58.74 v47.15,58.98 | C16.1 49.2,59.06 v49.13,59.13 | U4.11 46.26,51.37 | U4.4 41.71,53.06 41.91,53.26 43.74,53.26 | 43.74,53.26 44.37,53.26 | 44.37,53.26 44.93,53.26 | 44.93,53.26 46.04,53.26 46.26,53.03 U4.11 | U4.9 44.96,53.22 44.93,53.26 | U4.8 44.31,53.2 44.37,53.26 | U4.7 43.66,53.19 43.74,53.26 | U5.12 58.03,50.88 v57.78,50.64 57.38,50.64 | U5.10 56.73,50.99 57.07,50.64 57.38,50.64 | U5.11 57.38,50.64 | U5.13 58.03,58.74 v58.26,58.98 | U4.11 46.26,50.97 46.35,50.88 46.91,50.88 | 46.91,50.88 47.94,50.88 | 47.94,50.88 48.74,50.88 48.97,51.11 C11.1 | U4.12 46.91,50.88 | v47.86,51.36 47.86,50.96 47.94,50.88 | R11.P$1 29.42,12.26 28.73,12.94 27.54,12.94 v27.46,13.02 | U8.4 26.27,5.24 v26.43,5.08 | U19.11 44.37,14.84 44.53,14.68 45.01,14.68 | 45.01,14.68 46.2,14.68 v46.28,14.76 46.35,14.68 46.99,14.68 47.23,14.92 R4.P$1 | U19.10 45.01,14.68 | C17.1 47.31,11.74 v46.67,12.38 44.53,12.38 44.37,12.22 U19.6 | C62.1 49.28,35.57 v48.9,36.04 | U9.7 44.36,22.07 v43.81,22.62 | U17.2 v38.1,25.32 | U9.26 41.76,26.58 v41.91,26.43 42.41,26.93 U9.25 | U9.18 46.96,26.7 v47.23,26.43 | C1.2 50.97,26.84 v50.88,26.75 | R7.P$1 33.7,47.83 32.62,46.75 | U18.2 35.16,25.24 v35.32,25.32 | v20.24,10.56 21,9.79 R24.P$1 21,7.89 21.24,7.65 R23.P$1 | U10.144 13.55,26.18 v14.37,26.99
  Top 0.61: Y1.2 46.55,46.79 v47.7,47.94
  Top 1.27: U11.2 32.7,4.05 v33.42,4.76 34.77,4.76 35.48,4.05 U11.4 | U15.1 12.23,55.01 v12.3,55.09
  Bottom 0.254: C52.1 14.04,30.08 v13.89,29.92 | v13.89,32.86 13.98,32.85 15.15,32.85 15.24,32.94 C48.1 C45.1 | C58.1 15.39,25.63 v15.24,25.56 | C49.1 29.76,44.14 v29.61,44.21 | C26.1 13.25,18.9 v13.26,19.05 | C34.1 12.63,10.63 v12.7,10.56 | C33.1 4.12,9.84 v4.05,9.68 | C5.1 21.03,18.57 v20.8,18.34 | R30.P$1 v8.57,75.8 | R49.P$1 v27.62,75.8 | R31.P$1 11.27,75.72 v11.19,75.8 | R34.P$1 13.97,75.56 v13.73,75.8 | R37.P$1 16.67,75.41 v16.27,75.8 | R40.P$1 19.53,75.41 v19.92,75.8 | R43.P$1 22.23,75.56 v22.46,75.8 | R46.P$1 24.92,75.72 v25,75.8 | C39.1 16.42,34.85 v16.59,34.77 | C53.1 16.34,36.2 v16.51,36.2 | C54.1 16.34,37.71 v16.51,37.7 | C51.1 17.47,41.74 v17.54,41.59 | C47.1 C44.1 22.54,44.2 v22.46,44.21 | C38.1 24.61,41.82 v24.69,41.59 | C50.1 26.12,41.68 v26.11,41.59 | R14.P$1 41.78,3.44 J5.2 43.18,5.79 42.39,6.58 C18.1 | R13.P$1 45.75,2.11 45.48,2.38 45.48,4.6 J5.4 | R12.P$1 51.09,2.1 50.48,2.7 50.48,4.52 J5.6 | C24.1 22.54,28.57 v22.15,28.34 22.14,28.17 C59.1 | C46.1 C41.1 24.77,25.79 v25,25.56 | v26.59,25.56 27.07,25.56 27.22,25.71 C40.1 | C60.1 30.01,25.71 30.16,25.56 v30.56,25.56 31.04,25.56 31.19,25.71 C42.1 | C55.1 32.39,29.3 v32.54,29.45 | C37.1 32.23,33.01 32.54,32.78 v32.54,32.31 | C20.1 41.84,33.5 v41.91,33.42 | C57.1 C56.1 32.39,39.93 v32.54,40.08 | v44.77,26.51 44.92,26.36 C4.1 C3.1 | C43.1 32.46,35.17 v32.46,35.24 | C61.1 37.7,32.14 v37.86,32.31 | C63.1 18.18,2.07 v18.18,2.14 | C19.1 40.24,6.83 v40.48,6.59 | C2.1 50.32,14.47 J3.5 | 43.5,22.62 v43.81,22.62 43.1,22.62 42.95,22.77 C22.1 | C30.1 40.17,23.17 v39.85,23.5 | C28.1 38.09,25.25 v38.1,25.32 | C31.1 33.27,21.68 v33.02,21.43 | C25.1 7.95,18.74 v8.73,19.45
  Bottom 0.254: v21.99,13.65 22.3,13.65 22.54,13.88 C6.1 | C29.1 35.16,25.41 v35.32,25.32
  Bottom 0.406: C71.1 13.12,52.15 U15.1 12.23,55.01 v12.3,55.09
  Bottom 0.61: C69.1 34.03,5.37 v33.42,4.76 32.73,4.07 C70.1 | C68.1 12.28,55.11 v12.3,55.09
  pour Route2 (isolate 0.406, no thermals): 0,83.34 59.37,83.34 59.37,0 0,0
FLASH_CLK
  Top 0.254: U8.6 17.86,3.97 17.3,3.41 7.14,3.41 6.81,3.74 U7.37
FLASH_CS
  Top 0.254: U7.32 1.72,7.44 1.43,7.14 1.43,6.27 5.24,2.46 15.08,2.46 16.91,0.64 23.99,0.64 U8.1
FLASH_HOLD
  Top 0.254: U7.35 5.21,3.52 5.79,2.94 18.41,2.94 18.65,2.7 U8.7
FLASH_SDI
  Top 0.254: U7.43 11.61,4.1 11.83,3.89 14.76,3.89 15.56,4.68 16.91,4.68 17.46,5.24 U8.5
FLASH_SDO
  Top 0.254: U7.42 10.81,5.97 10.95,6.11 12.94,6.11 13.57,5.48 16.67,5.48 17.14,5.95 20.88,5.95 21.99,4.84 21.99,3.1 22.38,2.7 U8.2
FPGA_CCLK  (via drill 0.25)
  Top 0.254: U10.70 35.21,42.67 35.48,42.94 35.48,45.32 v35.24,45.56 35.24,46.28 35.21,46.31 R7.P$2 | U7.38 v7.61,7.69 v7.62,7.7
  Bottom 0.254: v35.24,45.56 33.89,46.91 10.64,46.91 9.76,46.04 9.76,13.81 7.62,11.67 v7.62,7.7
FPGA_DIN  (via drill 0.25)
  Top 0.254: U10.65 35.57,40.17 v35.96,40.56 | U7.2 17.36,7.44 v17.78,7.86
  Bottom 0.254: v35.96,40.56 40.96,35.56 40.96,21.11 36.91,17.07 35.8,17.07 26.59,7.86 v17.78,7.86
FPGA_DONE  (via drill 0.25)
  Top 0.254: U10.71 34.92,43.17 35,43.26 35,44.61 v34.53,45.09 34.45,45.16 | U7.41 10.01,7.71 v10.08,7.78
  Bottom 0.254: v10.08,7.78 10.08,11.75 10.48,12.14 10.48,45.16 11.75,46.43 33.18,46.43 v34.53,45.09 33.89,44.45 R8.P$1
FPGA_INIT_B  (via drill 0.25)
  Top 0.254: U7.36 6.01,6.65 v6.43,7.06 | U10.39 32.73,27.18 v32.54,26.99
  Bottom 0.254: v6.43,7.06 10.56,7.06 20.64,17.14 25.8,17.14 32.54,23.89 v32.54,26.99 32.54,27.7 32.23,28.02 30.53,28.02 R9.P$1
FPGA_PROGRAM_B  (via drill 0.25)
  Top 0.254: U7.40 9.21,6.2 v9.37,6.35 | U10.37 33.88,25.34 v33.89,25.24 33.18,24.45 R10.P$1
  Bottom 0.254: v9.37,6.35 10.72,6.35 13.57,9.21 13.65,9.21 20.95,16.51 26.11,16.51 33.89,24.29 v33.89,25.24
JMP1
  Top 0.254: U10.118 9.41,39.17 7.06,36.83 7.06,25.08 5.08,23.1 2.86,23.1 J6.1
  Bottom 0.254: R21.P$1 5.91,21.72 4.68,22.94 2.7,22.94 J6.1
JMP2
  Top 0.254: U10.117 9.27,39.67 6.59,36.99 6.59,27.46 4.76,25.64 2.86,25.64 J6.3
  Bottom 0.254: R20.P$1 5.99,24.42 5,25.4 2.62,25.4 J6.3
JMP3
  Top 0.254: U10.116 9.14,40.17 6.11,37.15 6.11,29.45 4.76,28.1 2.78,28.1 J6.5
  Bottom 0.254: R19.P$1 6.03,26.91 4.92,28.02 2.7,28.02 J6.5
JMP4
  Top 0.254: U10.115 9,40.67 5.64,37.31 5.64,31.43 4.84,30.64 2.78,30.64 J6.7
  Bottom 0.254: R6.P$1 6.06,29.42 4.92,30.56 2.7,30.56 J6.7
JMP5
  Top 0.254: U10.114 8.87,41.17 5.16,37.47 5.16,33.58 4.84,33.26 2.86,33.26 J6.9
  Bottom 0.254: R15.P$1 6.14,31.96 4.92,33.18 2.78,33.18 J6.9
JMP6
  Top 0.254: U10.112 9.23,42.17 J6.11
  Bottom 0.254: R16.P$1 6.14,34.5 5.08,35.56 2.62,35.56 J6.11
N$1
  Top 0.254: U6.35 25.9,11.32 26.43,10.79 C23.1
N$2
  Top 0.254: U9.19 46.31,25.76 49.69,22.38 49.69,17.99 R5.P$1 R4.P$2
N$3
  Top 0.254: U10.50 36.25,32.67 37.64,34.07 U12.4
N$4
  Top 0.254: U9.15 48.91,26.73 50.96,24.69 50.96,15.85 J3.3
N$5
  Top 0.254: U9.17 47.61,29.12 47.78,29.29 50.09,29.29 50.32,29.06 C1.1
N$6
  Top 0.254: U9.23 43.71,31.17 43.89,31.35 R2.P$2
N$7
  Top 0.254: R3.P$2 44.45,30.08 44.36,30 U9.22
N$8
  Top 0.254: U9.16 48.26,26.59 50.48,24.37 50.48,14.92 51.52,13.88 J3.2
N$9
  Top 0.254: R2.P$1 D1.C
N$10
  Top 0.254: R3.P$1 D2.C
N$11  (via drill 0.25)
  Top 0.254: U7.17 8.41,15.08 v8.18,14.84
  Bottom 0.254: v8.18,14.84 7.78,14.45 1.67,14.45 1.19,13.97 1.19,3.33 2.14,2.38 7.86,2.38 J2.4
N$12  (via drill 0.25)
  Top 0.254: U7.18 7.61,15.31 v7.38,15.08 | R1.P$1 0.98,2.83 1.35,2.46 J2.1
  Bottom 0.254: v7.38,15.08 1.51,15.08 0.71,14.29 0.71,1.91 J2.1
N$13  (via drill 0.25)
  Top 0.254: U7.16 9.21,14.85 v8.97,14.61
  Bottom 0.254: v8.97,14.61 8.33,13.97 2.14,13.97 1.75,13.57 1.75,3.97 2.86,2.86 9.92,2.86 J2.5
N$14
  Top 0.254: U17.4 37.45,19.54 38.89,18.1 42.55,18.1 43.1,17.54 U19.13
N$15
  Top 0.254: J3.1 50.1,13.08 48.9,14.29 R5.P$2
  Bottom 0.254: C2.2 52.12,13.1 J3.1
N$17
  Top 0.254: U6.36 28.07,12.33 29.05,11.35 30.84,11.35 R22.P$1 C21.2 32.71,10.72 D3.1
N$18
  Top 0.254: D4.C R27.P$2
N$19
  Top 0.254: U6.37 29.51,13.76 R11.P$2
N$20
  Bottom 0.254: R28.P$2 R29.P$1 7.91,69.01 7.14,69.77 7.14,72.31 7.97,73.14 R30.P$2
N$21
  Bottom 0.254: R17.P$2 R18.P$1 10.6,69.01 9.84,69.77 9.84,72.31 10.67,73.14 R31.P$2
N$22
  Bottom 0.254: R32.P$2 R33.P$1 13.3,69.01 12.54,69.77 12.54,72.31 13.37,73.14 R34.P$2
N$23
  Top 0.254: U12.3 44.23,34.07 45.48,35.32 Y1.3
N$24
  Top 0.254: U13.4 9.51,19.54 9.29,19.76 9.29,20.08 9.45,20.32 12.94,20.32 14.05,19.21 14.05,16.35 17.22,13.18 19.45,13.18 19.76,12.86 19.76,12.06 21.83,10 21.83,8.81 24.21,6.43 26.67,6.43 27.78,5.32 27.78,1.11 28.26,0.64 51.75,0.64 53.02,1.91 53.02,3.73 54.29,5 J5.10
N$28
  Top 0.254: U7.10 15.14,13.84 16.95,12.02 D8.A
N$29
  Top 0.254: U7.11 15.13,14.64 17.07,12.7 18.65,12.7 18.81,12.54 D9.A
N$30
  Top 0.254: D8.C 17.54,8.97 19.45,7.06 R23.P$2
N$31
  Top 0.254: D9.C 18.81,9.84 19.48,9.18 R24.P$2
N$32
  Bottom 0.254: R35.P$2 R36.P$1 16,69.01 15.24,69.77 15.24,72.31 16.07,73.14 R37.P$2
N$33
  Top 0.254: U19.8 46.65,10.81 C17.2
N$35
  Top 0.254: U18.4 34.51,18.75 35.72,17.54 41.59,17.54 41.83,17.3 U19.15
N$36
  Top 0.254: J5.7 53.02,4.52 53.02,7.06 46.43,13.65 41.91,13.65 41.2,14.37 U19.16
N$37
  Top 0.254: J5.9 55.56,4.52 55.56,6.51 53.18,8.89 52.78,8.89 47.55,14.13 43.1,14.13 42.47,14.76 U19.14
N$38
  Bottom 0.254: R38.P$2 R39.P$1 18.86,69.01 18.1,69.77 18.1,72.31 18.92,73.14 R40.P$2
N$39
  Bottom 0.254: R41.P$2 R42.P$1 21.56,69.01 20.8,69.77 20.8,72.31 21.62,73.14 R43.P$2
N$40
  Bottom 0.254: R44.P$2 R45.P$1 24.26,69.01 23.5,69.77 23.5,72.31 24.32,73.14 R46.P$2
N$41
  Bottom 0.254: R47.P$2 R48.P$1 26.96,69.01 26.19,69.77 26.19,72.31 27.02,73.14 R49.P$2
PIC_D0
  Top 0.254: U10.131 11.48,32.67 10.87,32.07 10.87,22.46 6.81,18.4 U7.19
PIC_D1
  Top 0.254: U10.127 11.34,34.67 10.4,33.73 10.4,22.62 6.01,18.24 U7.20
PIC_D2
  Top 0.254: U10.126 10.25,35.17 9.92,34.85 9.92,22.78 5.21,18.07 U7.21
PIC_D3
  Top 0.254: U10.124 9.58,36.17 9.45,36.04 9.45,22.94 4.41,17.91 U7.22
PIC_D4
  Top 0.254: U10.123 9.45,36.67 8.97,36.2 8.97,23.1 2.71,16.84 U7.23
PIC_D5
  Top 0.254: U10.121 9.81,37.67 8.49,36.35 8.49,23.26 1.67,16.43 1.67,13.97 1.8,13.84 U7.24
PIC_D6
  Top 0.254: U10.119 9.54,38.67 7.54,36.67 7.54,23.57 0.71,16.75 0.71,8.81 1.29,8.24 U7.31
PIC_D7
  Top 0.254: U10.120 9.68,38.17 8.02,36.51 8.02,23.42 1.19,16.59 1.19,9.45 1.6,9.04 U7.30
PIC_GPIO1  (via drill 0.25)
  Top 0.254: U10.45 37.06,30.18 v37.39,29.84 | U7.4 15.31,9.04 v15.4,9.13
  Bottom 0.254: v37.39,29.84 37.39,20.8 25.72,9.13 v15.4,9.13
PIC_GPIO2  (via drill 0.25)
  Top 0.254: U10.44 36.21,29.68 v36.59,29.29 | U7.5 15.31,9.84 v15.4,10
  Bottom 0.254: v36.59,29.29 36.83,29.05 36.83,21.27 25.48,9.92 15.48,9.92 v15.4,10
PIC_GPIO3  (via drill 0.25)
  Top 0.254: U7.25 3.75,13.04 4.29,13.57 4.29,14.76 3.33,15.72 3.33,16.43 v3.57,16.67 | v35.72,28.97 35.16,28.97 34.96,29.18 U10.43
  Bottom 0.254: v3.57,16.67 4.13,16.67 8.97,21.51 8.97,46.51 9.84,47.39 35.24,47.39 36.27,46.35 36.27,42.94 35.16,41.83 35.16,29.53 v35.72,28.97
PPU_/CS
  Top 0.254: U10.66 35.2,40.67 36.43,41.91 36.43,47.94 34.06,50.32 U2.7
PPU_/INT
  Top 0.254: U4.10 45.61,50.93 45.56,50.88 43.81,50.88 42.62,49.69 39.53,49.69 38.39,48.55 38.39,39.03 36.04,36.67 U10.58
PPU_/RD
  Top 0.254: U4.5 42.36,50.94 42.07,50.64 39.05,50.64 37.36,48.95 37.36,39.43 36.11,38.17 U10.61
PPU_/RST
  Top 0.254: U2.8 34.71,50.46 36.91,48.26 36.91,40.56 35.02,38.67 U10.62
PPU_/WR
  Top 0.254: U4.6 43.01,50.87 42.31,50.16 39.29,50.16 37.93,48.81 37.93,39.28 35.83,37.17 U10.59
PPU_A0
  Top 0.254: U10.67 35.06,41.17 35.96,42.07 35.96,47.62 33.41,50.17 U2.6
PPU_A1
  Top 0.254: U2.5 32.76,50.46 30.93,48.63 U10.75
PPU_A2
  Top 0.254: U2.4 32.11,50.6 29.43,47.92 U10.78
PPU_A8
  Top 0.254: U10.47 42.13,31.18 43.58,32.62 50.96,32.62 55.43,37.09 U5.8
PPU_A9
  Top 0.254: U10.48 41.99,31.68 43.42,33.1 49.93,33.1 54.78,37.95 U5.7
PPU_A10
  Top 0.254: U5.6 54.13,50.79 52.31,48.97 44.77,48.97 43.58,47.78 40.8,47.78 40.48,47.47 40.48,37.7 35.95,33.17 U10.51
PPU_A11
  Top 0.254: U5.5 53.48,50.78 52.15,49.45 44.53,49.45 43.34,48.26 40.32,48.26 40.01,47.94 40.01,38.18 37,35.17 U10.55
PPU_A12
  Top 0.254: U5.4 52.83,50.84 51.91,49.93 44.29,49.93 43.1,48.74 40.08,48.74 39.45,48.1 39.45,38.5 36.63,35.67 U10.56
PPU_A13
  Top 0.254: U5.3 52.18,50.83 51.75,50.4 44.05,50.4 42.86,49.21 39.77,49.21 38.89,48.34 38.89,38.73 36.33,36.17 U10.57
PPU_AD0
  Top 0.254: U1.3 3.76,49.98 6.35,47.39 15.88,47.39 16.43,46.83 U10.104
PPU_AD1
  Top 0.254: U1.4 4.41,50.12 6.67,47.86 16.91,47.86 17.43,47.34 U10.102
PPU_AD2
  Top 0.254: U1.5 5.06,50.27 6.99,48.34 17.22,48.34 17.93,47.64 U10.101
PPU_AD3
  Top 0.254: U1.6 5.71,50.41 7.3,48.82 17.54,48.82 18.43,47.93 U10.100
PPU_AD4
  Top 0.254: U1.7 6.36,50.55 7.62,49.29 17.86,49.29 18.93,48.22 U10.99
PPU_AD5
  Top 0.254: U1.8 7.01,50.7 7.94,49.77 18.18,49.77 19.43,48.52 U10.98
PPU_AD6
  Top 0.254: U1.9 7.66,50.84 8.26,50.24 18.49,50.24 19.93,48.81 U10.97
PPU_AD7
  Top 0.254: U1.10 8.31,50.99 8.57,50.72 18.73,50.72 20.93,48.53 U10.95
PPU_AD_DIR
  Top 0.254: U1.2 3.11,49.84 6.03,46.91 15.72,46.91 15.88,46.75 15.93,46.7 U10.105
PPU_ALE
  Top 0.254: U10.46 42.26,30.68 43.42,31.83 43.74,32.15 51.44,32.15 56.08,36.79 U5.9
PPU_BUFF_OE  (via drill 0.25)
  Top 0.254: U10.80 28.43,48.8 28.02,49.21 28.02,55.8 | U1.22 3.76,56.57 v4.52,55.8 | 28.02,55.8 v21.27,55.8 21.22,55.85 U3.22 | U5.22 52.18,56.7 51.28,55.8 40.96,55.8 | 40.96,55.8 31.51,55.8 | 31.51,55.8 28.02,55.8 | U4.22 41.06,55.91 40.96,55.8 | U2.22 31.46,55.85 31.51,55.8
  Bottom 0.254: v21.27,55.8 17.38,60.01 8.65,60.01 4.6,55.8 v4.52,55.8
PPU_CLK  (via drill 0.25)
  Top 0.254: U10.88 24.43,46.85 v23.18,48.02 | U2.9 35.36,51 v36.35,50.01
  Bottom 0.254: v36.35,50.01 34.37,48.02 v23.18,48.02
PPU_D0
  Top 0.254: U3.3 21.22,49.66 21.93,48.95 U10.93
PPU_D1
  Top 0.254: U3.4 21.87,49.73 22.43,49.17 U10.92
PPU_D2
  Top 0.254: U3.5 22.52,49.79 24.93,47.38 U10.87
PPU_D3
  Top 0.254: U3.6 23.17,49.85 25.93,47.1 U10.85
PPU_D4
  Top 0.254: U3.7 23.82,49.92 26.43,47.31 U10.84
PPU_D5
  Top 0.254: U3.8 24.47,49.98 26.93,47.53 U10.83
PPU_D6
  Top 0.254: U3.9 25.12,50.13 27.43,47.82 U10.82
PPU_D7
  Top 0.254: U3.10 25.77,50.27 27.93,48.11 U10.81
PPU_D_DIR
  Top 0.254: U3.2 20.57,49.6 21.43,48.74 U10.94
PPU_R/W
  Top 0.254: U2.3 31.46,50.91 28.93,48.37 U10.79
R/W
  Top 0.254: J1.1 8.26,64.69 27.3,64.69 28.26,63.74 28.26,62.63 32.11,58.77 U2.21
TCK  (via drill 0.25)
  Top 0.254: U10.109 7.12,43.67 v6.83,43.97
  Bottom 0.254: v6.83,43.97 6.83,48.34 7.62,49.13 33.58,49.13 39.45,55.01 50.88,55.01 54.29,51.59 54.29,31.99 54.77,31.51 56.26,31.51 J4.6
TDI  (via drill 0.25)
  Top 0.254: U10.110 6.28,43.17 v5.56,43.58
  Bottom 0.254: v5.56,43.58 5.56,48.42 7.22,50.09 32.94,50.09 39.13,56.28 51.44,56.28 56.36,51.36 56.36,37.31 58.42,35.24 58.42,27.64 J4.10
TDO  (via drill 0.25)
  Top 0.254: v7.54,44.53 7.7,44.37 13.34,44.37 13.73,43.97 15.32,43.97 15.43,44.08 U10.106
  Bottom 0.254: v7.54,44.53 7.54,47.31 8.89,48.66 33.81,48.66 39.37,54.21 50.48,54.21 53.74,50.96 53.74,30.08 54.29,29.53 56.24,29.53 J4.8
TMS  (via drill 0.25)
  Top 0.254: U10.107 14.93,44.61 14.84,44.53 13.89,44.53 13.26,45.16 6.35,45.16 v6.19,45.24
  Bottom 0.254: v6.19,45.24 6.19,48.34 7.46,49.61 33.18,49.61 39.21,55.64 51.04,55.64 55.56,51.12 55.56,36.99 56.28,36.27 56.28,33.5 J4.4
USB_CTS  (via drill 0.25)
  Top 0.254: U9.11 46.96,19.5 v46.75,19.29 | v8.41,6.43 U7.39
  Bottom 0.254: v46.75,19.29 44.53,17.07 41.59,17.07 28.89,4.37 16.51,4.37 15.95,3.81 8.65,3.81 8.41,4.05 v8.41,6.43
USB_PWREN  (via drill 0.25)
  Top 0.254: U9.14 48.91,19.46 48.1,18.65 39.53,18.65 v38.1,20.16 | U7.9 15.22,13.04 16.51,11.75 16.51,8.97 v16.99,8.49
  Bottom 0.254: v16.99,8.49 17.07,8.57 26.51,8.57 v38.1,20.16
USB_RTS  (via drill 0.25)
  Top 0.254: U9.3 41.76,19.46 v41.59,19.29 | v16.03,8.1 16.03,11.43 15.23,12.24 U7.8
  Bottom 0.254: v41.59,19.29 28.73,6.43 17.7,6.43 v16.03,8.1
USB_RXD  (via drill 0.25)
  Top 0.254: U9.5 43.06,19.49 v42.86,19.29 | U7.44 13.64,4.94 v13.81,4.76
  Bottom 0.254: v42.86,19.29 29.53,5.95 15,5.95 v13.81,4.76
USB_TXD  (via drill 0.25)
  Top 0.254: U9.1 40.46,19.51 v40.24,19.29 | U7.1 17.83,6.64 v18.41,7.22
  Bottom 0.254: v40.24,19.29 28.18,7.22 v18.41,7.22
VID_ONEWIRE
  Top 0.254: U7.14 10.81,17.4 11.27,17.86 11.27,19.21 11.6,19.54 U13.3
VID_ONEWIRE_DIR
  Top 0.254: U7.15 10.01,17.37 9.84,17.54 8.57,17.54 8.41,17.7 8.41,18.57 8.49,18.65 8.73,18.73 9.05,18.89 U13.5
VIDEO_/BLANK
  Top 0.254: U6.11 21.4,21.78 19.93,23.25 U10.12
VIDEO_/SYNC
  Top 0.254: U6.12 20.9,21.64 19.43,23.12 U10.11
VIDEO_B0
  Top 0.254: U6.16 18.51,17.76 18.34,17.94 18.34,19.84 18.93,20.44 U10.10
VIDEO_B1
  Top 0.254: U6.17 18.38,17.26 17.86,17.78 17.86,20 18.43,20.57 U10.9
VIDEO_B2
  Top 0.254: U6.18 18.16,16.76 17.38,17.54 17.38,20.16 17.93,20.71 U10.8
VIDEO_B3
  Top 0.254: U6.19 18.03,16.26 16.91,17.38 16.91,20.32 17.43,20.84 U10.7
VIDEO_B4
  Top 0.254: U6.20 17.89,15.76 16.43,17.22 16.43,20.48 16.93,20.98 U10.6
VIDEO_B5
  Top 0.254: U6.21 17.76,15.26 15.95,17.07 15.95,20.64 16.43,21.11 U10.5
VIDEO_B6
  Top 0.254: U6.22 17.62,14.76 15.48,16.91 15.48,19.84 14.93,20.39 U10.2
VIDEO_B7
  Top 0.254: U6.23 17.41,14.26 15,16.67 15,19.68 14.43,20.26 U10.1
VIDEO_CLOCK
  Top 0.254: U6.24 17.28,13.76 14.53,16.51 14.53,19.53 13.97,20.08 13.97,23.26 11.35,25.88 11.35,31.04 11.49,31.18 U10.134
VIDEO_G0
  Top 0.254: U6.3 25.4,22.39 25.93,22.91 U10.24
VIDEO_G1
  Top 0.254: U6.4 24.9,22.52 25.43,23.05 U10.23
VIDEO_G2
  Top 0.254: U6.5 24.4,22.66 24.93,23.18 U10.22
VIDEO_G3
  Top 0.254: U6.6 23.9,22.79 24.43,23.32 U10.21
VIDEO_G4
  Top 0.254: U6.7 23.4,22.32 22.43,23.29 U10.17
VIDEO_G5
  Top 0.254: U6.8 22.9,22.18 21.93,23.16 U10.16
VIDEO_G6
  Top 0.254: U6.9 22.4,22.05 21.43,23.02 U10.15
VIDEO_G7
  Top 0.254: U6.10 21.9,21.91 20.93,22.89 U10.14
VIDEO_OUT_BLUE
  Top 0.254: U6.28 22.4,9.74 23.89,8.26 36.2,8.26 40.08,12.14 42.31,12.14 42.47,11.99 U19.3 42.47,8.65 43.34,7.78 44.37,7.78 45.4,6.75 45.4,4.52 J5.1
  Bottom 0.254: R14.P$2 43.31,2.43 J5.1
VIDEO_OUT_GREEN
  Top 0.254: U6.32 24.4,9.81 25.48,8.73 35.96,8.73 39.85,12.62 42.7,12.62 43.1,12.22 U19.4 43.1,9.05 43.66,8.49 46.2,8.49 48.02,6.67 48.02,4.6 J5.3
  Bottom 0.254: R13.P$2 47.28,2.65 J5.3
VIDEO_OUT_RED
  Top 0.254: U6.34 25.4,9.92 26.11,9.21 35.72,9.21 39.61,13.1 43.26,13.1 43.74,12.62 U19.5 43.74,9.84 44.29,9.29 47.86,9.29 50.48,6.67 50.48,4.52 J5.5
  Bottom 0.254: R12.P$2 49.56,2.9 J5.5
VIDEO_R0
  Top 0.254: U6.41 29.81,15.76 32.31,18.26 32.31,21.11 31.43,21.99 U10.35
VIDEO_R1
  Top 0.254: U6.42 29.67,16.26 31.83,18.41 31.83,20.95 30.93,21.86 U10.34
VIDEO_R2
  Top 0.254: U6.43 29.54,16.76 31.35,18.57 31.35,20.72 30.43,21.64 U10.33
VIDEO_R3
  Top 0.254: U6.44 29.4,17.26 30.88,18.73 30.88,20.56 29.93,21.51 U10.32
VIDEO_R4
  Top 0.254: U6.45 29.27,17.76 30.4,18.89 30.4,20.4 28.93,21.87 U10.30
VIDEO_R5
  Top 0.254: U6.46 29.13,18.26 29.92,19.05 29.92,20.24 28.43,21.74 U10.29
VIDEO_R6
  Top 0.254: U6.47 29,18.76 29.45,19.21 29.45,20.08 27.43,22.1 U10.27
VIDEO_R7
  Top 0.254: U6.48 28.79,19.26 28.97,19.45 28.97,19.92 26.93,21.97 U10.26
VSYNC
  Top 0.254: U10.40 34.87,27.68 35.4,27.15 35.4,26.27 34.51,25.39 U18.3

## Text on the board
tPlace: Universal PPU | Rev. 2 / April 2014 | http://www.universalppu.com/ | INV | 2C05 | NTSC | PAL4 | PAL2 | PAL1 | <- PIN 1